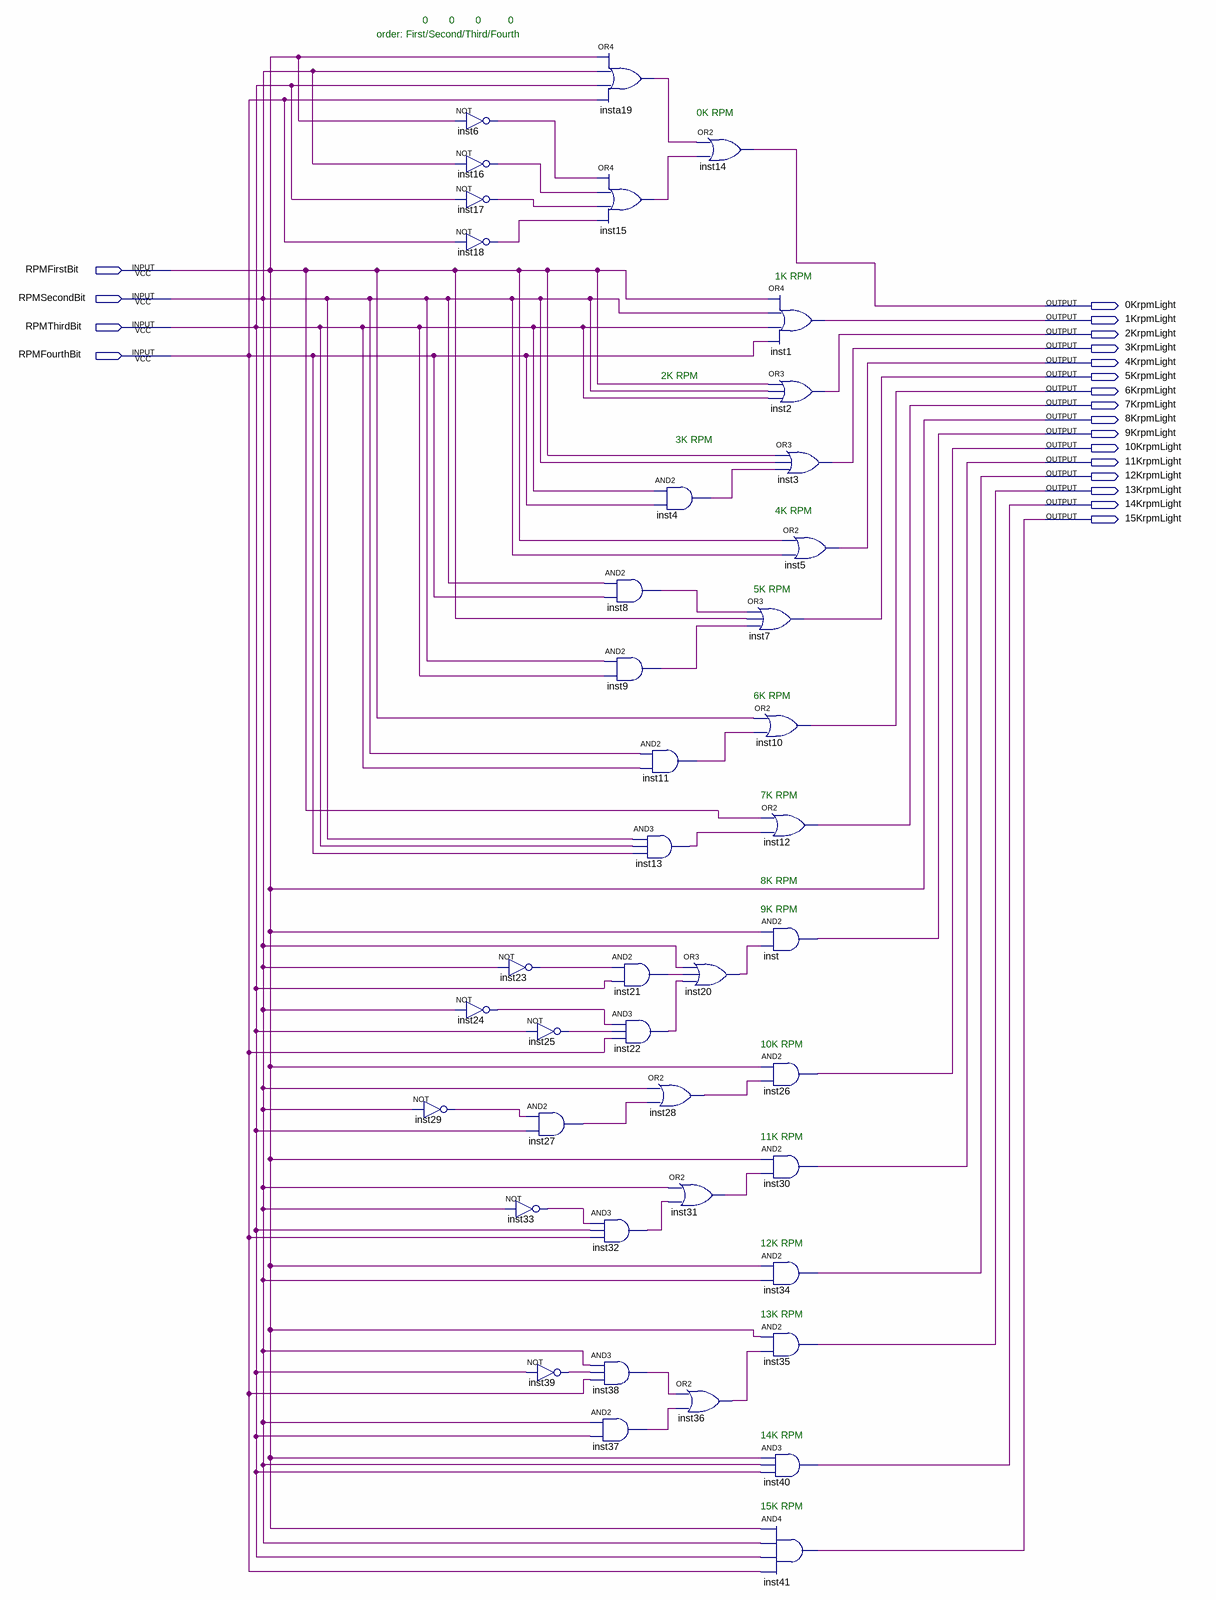
[diagram p0: schematic sheet]
// Quartus schematic RpmEquations.bdf as structural Verilog: 42 symbols, 20 pins
module RpmEquations (
  input  RPMFirstBit,
  input  RPMSecondBit,
  input  RPMThirdBit,
  input  RPMFourthBit,
  output \0KrpmLight ,
  output \1KrpmLight ,
  output \2KrpmLight ,
  output \3KrpmLight ,
  output \4KrpmLight ,
  output \5KrpmLight ,
  output \6KrpmLight ,
  output \7KrpmLight ,
  output \8KrpmLight ,
  output \9KrpmLight ,
  output \10KrpmLight ,
  output \11KrpmLight ,
  output \12KrpmLight ,
  output \13KrpmLight ,
  output \14KrpmLight ,
  output \15KrpmLight 
);

  wire inst4_out, inst6_out, inst8_out, inst9_out, inst11_out, inst13_out, inst15_out, inst16_out,
       inst17_out, inst18_out, inst20_out, inst21_out, inst22_out, inst23_out, inst24_out, inst25_out,
       inst27_out, inst28_out, inst29_out, inst31_out, inst32_out, inst33_out, inst36_out, inst37_out,
       inst38_out, inst39_out, insta19_out;

  not inst29 (inst29_out, RPMSecondBit);
  not inst6 (inst6_out, RPMFirstBit);
  not inst16 (inst16_out, RPMSecondBit);
  not inst17 (inst17_out, RPMThirdBit);
  not inst18 (inst18_out, RPMFourthBit);
  not inst24 (inst24_out, RPMSecondBit);
  not inst23 (inst23_out, RPMSecondBit);
  not inst25 (inst25_out, RPMThirdBit);
  and inst27 (inst27_out, inst29_out, RPMThirdBit);
  not inst33 (inst33_out, RPMSecondBit);
  not inst39 (inst39_out, RPMThirdBit);
  or insta19 (insta19_out, RPMFirstBit, RPMSecondBit, RPMThirdBit, RPMFourthBit);
  or inst15 (inst15_out, inst6_out, inst16_out, inst17_out, inst18_out);
  and inst8 (inst8_out, RPMSecondBit, RPMFourthBit);
  and inst9 (inst9_out, RPMSecondBit, RPMThirdBit);
  and inst11 (inst11_out, RPMSecondBit, RPMThirdBit);
  and inst13 (inst13_out, RPMSecondBit, RPMThirdBit, RPMFourthBit);
  and inst21 (inst21_out, inst23_out, RPMThirdBit);
  and inst22 (inst22_out, inst24_out, inst25_out, RPMFourthBit);
  and inst32 (inst32_out, inst33_out, RPMThirdBit, RPMFourthBit);
  and inst38 (inst38_out, RPMSecondBit, inst39_out, RPMFourthBit);
  and inst37 (inst37_out, RPMSecondBit, RPMThirdBit);
  or inst14 (\0KrpmLight , insta19_out, inst15_out);
  and inst4 (inst4_out, RPMThirdBit, RPMFourthBit);
  or inst20 (inst20_out, RPMSecondBit, inst21_out, inst22_out);
  or inst28 (inst28_out, RPMSecondBit, inst27_out);
  or inst31 (inst31_out, RPMSecondBit, inst32_out);
  or inst36 (inst36_out, inst38_out, inst37_out);
  or inst7 (\5KrpmLight , inst8_out, RPMFirstBit, inst9_out);
  or inst10 (\6KrpmLight , RPMFirstBit, inst11_out);
  or inst1 (\1KrpmLight , RPMFirstBit, RPMSecondBit, RPMThirdBit, RPMFourthBit);
  or inst2 (\2KrpmLight , RPMFirstBit, RPMSecondBit, RPMThirdBit);
  or inst3 (\3KrpmLight , RPMFirstBit, RPMSecondBit, inst4_out);
  or inst5 (\4KrpmLight , RPMFirstBit, RPMSecondBit);
  or inst12 (\7KrpmLight , RPMFirstBit, inst13_out);
  and inst (\9KrpmLight , RPMFirstBit, inst20_out);
  and inst26 (\10KrpmLight , RPMFirstBit, inst28_out);
  and inst30 (\11KrpmLight , RPMFirstBit, inst31_out);
  and inst34 (\12KrpmLight , RPMFirstBit, RPMSecondBit);
  and inst35 (\13KrpmLight , RPMFirstBit, inst36_out);
  and inst40 (\14KrpmLight , RPMFirstBit, RPMSecondBit, RPMThirdBit);
  and inst41 (\15KrpmLight , RPMFirstBit, RPMSecondBit, RPMThirdBit, RPMFourthBit);

  assign \8KrpmLight  = RPMFirstBit;

  // Notes on the sheet:
  //    0       0       0         0    
  //   order: First/Second/Third/Fourth  
  //   0K RPM 
  //   1K RPM 
  //   2K RPM 
  //   3K RPM 
  //   4K RPM 
  //   5K RPM 
  //   6K RPM 
  //   7K RPM 
  //   8K RPM 
  //   9K RPM 
  //   10K RPM 
  //   11K RPM 
  //   12K RPM 
  //   13K RPM 
  //   14K RPM 
  //   15K RPM 
endmodule
